# EAGLE design SP (EAGLE 9.4.2)
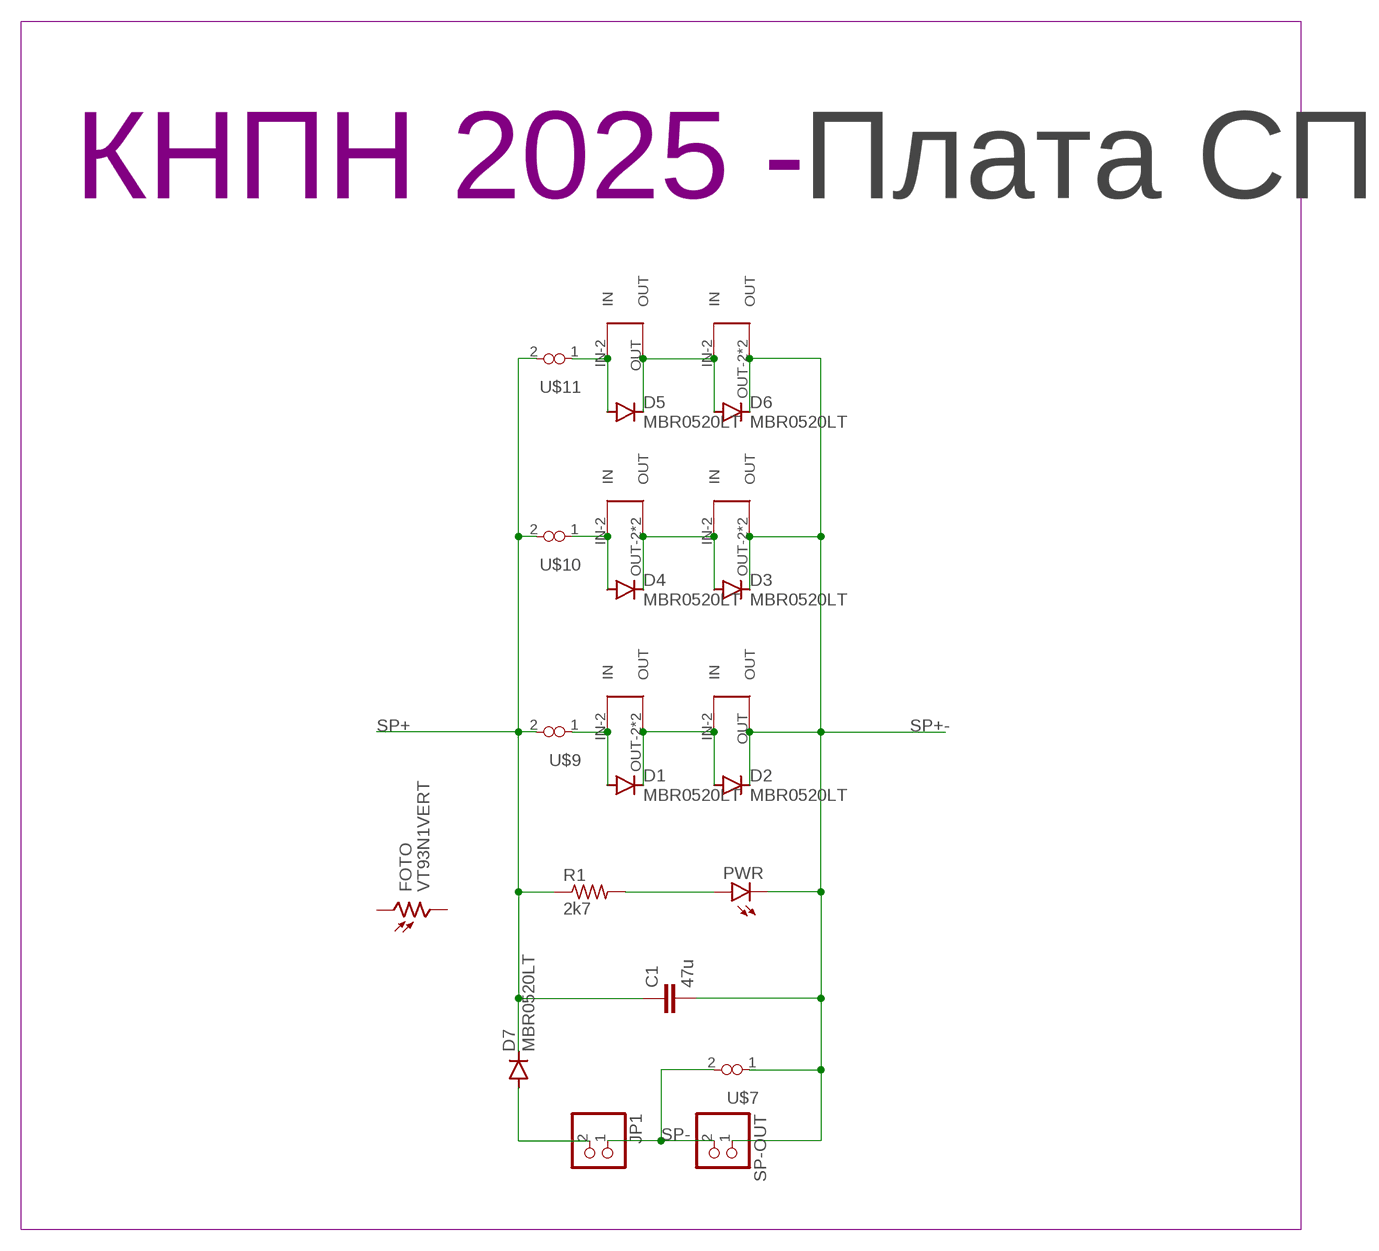
[diagram p0: schematic, sheet 1]

## Parts
C1  47u  C-EUC1210  [C1210]
D1  MBR0520LT  [SOD123]
D2  MBR0520LT  [SOD123]
D3  MBR0520LT  [SOD123]
D4  MBR0520LT  [SOD123]
D5  MBR0520LT  [SOD123]
D6  MBR0520LT  [SOD123]
D7  MBR0520LT  [SOD123]
FOTO  VT93N1VERT  [VT93N1-VERT]
JP1  PINHD-1X2  [1X02]
PWR  LEDCHIP-LED0603  [CHIP-LED0603]
R1  2k7  R-US_R0603  [R0603]
SP-OUT  PINHD-1X2  [1X02]
U$1  SOLAR-2_INVERT0-2  [SOLAR_0-2_INVERT]
U$2  SOLAR-2_INVERT1-2  [SOLAR_1-2_INVERT]
U$3  SOLAR-2_INVERT0-2  [SOLAR_0-2_INVERT]
U$4  SOLAR-2_INVERT0-2  [SOLAR_0-2_INVERT]
U$5  Плата СП  LOGOPCB-""  [LOGO]
U$6  SOLAR-2_INVERT1-2  [SOLAR_1-2_INVERT]
U$7  VIAS-CONNECT  [VIAS-CONNECT]
U$8  SOLAR-2_INVERT0-2  [SOLAR_0-2_INVERT]
U$9  VIAS-CONNECT  [VIAS-CONNECT]
U$10  VIAS-CONNECT  [VIAS-CONNECT]
U$11  VIAS-CONNECT  [VIAS-CONNECT]

## Nets
N$1: D7.A JP1.2
N$2: D5.A U$6.IN-2(IN) U$11.1
N$3: D4.A U$4.IN-2(IN) U$10.1
N$4: PWR.A R1.2
N$5: D1.C D2.A U$1.OUT-2(OUT) U$1.OUT-21(OUT) U$2.IN-2(IN)
N$6: D3.A D4.C U$3.IN-2(IN) U$4.OUT-2(OUT) U$4.OUT-21(OUT)
N$7: D1.A U$1.IN-2(IN) U$9.1
N$8: D5.C D6.A U$6.OUT U$8.IN-2(IN)
SP+: C1.1 D7.C R1.1 U$9.2 U$10.2 U$11.2
SP+-: C1.2 D2.C D3.C D6.C PWR.C SP-OUT.1 U$2.OUT U$3.OUT-2(OUT) U$3.OUT-21(OUT) U$7.1 U$8.OUT-2(OUT) U$8.OUT-21(OUT)
SP-: JP1.1 SP-OUT.2 U$7.2
Unconnected: FOTO.P$1 FOTO.P$2

## Library data of the parts
C1 = rcl:C-EU: CAPACITOR, European symbol; SPICEPREFIX: C
D1-D7 = diode:MBR0520LT: SCHOTTKY BARRIER RECTIFIER Source: http://onsemi.com .. MBR0520LT1-D.pdf
FOTO = KNPN-2023:VT93N1
JP1 SP-OUT = pinhead:PINHD-1X2: PIN HEADER
PWR = led:LED: LED OSRAM: - CHIPLED LG R971, LG N971, LY N971, LG Q971, LY Q971, LO R971, LY R971 LH N974, LH R974 LS Q976, LO Q976, LY Q976 LO Q996 - Hyper CHIPLED LW Q18S LB Q993, LB Q99A, LB R99A - SideLED LS A670, LO A670, LY A670, LG A670, LP A670 LB A673, LV A673, LT A673, LW A673 LH A674 LY A675 LS A676, LA A676, LO A676, LY A676, LW A676 LS A679, LY A679, LG A679 - Hyper Micro SIDELED® LS Y876, LA Y876, LO Y876, LY Y876 LT Y87S - SmartLED LW L88C, LW L88S LB L89C, LB L89S, LG L890 LS L89K, LO L89K, LY L89K LS L896, LA L896, LO L896, LY L896 - TOPLED LS T670, LO T670, LY T670, LG T670, LP T670 LSG T670, LSP T670, LSY T670, LOP T670, LYG T670 LG T671, LOG T671, LSG T671 LB T673, LV T673, LT T673, LW T673 LH T674 LS T676, LA T676, LO T676, LY T676, LB T676, LH T676, LSB T676, LW T676 LB T67C, LV T67C, LT T67C, LS T67K, LO T67K, LY T67K, LW E67C LS E67B, LA E67B, LO E67B, LY E67B, LB E67C, LV E67C, LT E67C LW T67C LS T679, LY T679, LG T679 LS T770, LO T770, LY T770, LG T770, LP T770 LB T773, LV T773, LT T773, LW T773 LH T774 LS E675, LA E675, LY E675, LS T675 LS T776, LA T776, LO T776, LY T776, LB T776 LHGB T686 LT T68C, LB T68C - Hyper Mini TOPLED® LB M676 - Mini TOPLED Santana® LG M470 LS M47K, LO M47K, LY M47K Source: http://www.osram.convergy.de LUXEON: - LUMILED® LXK2-PW12-R00, LXK2-PW12-S00, LXK2-PW14-U00, LXK2-PW14-V00 LXK2-PM12-R00, LXK2-PM12-S00, LXK2-PM14-U00 LXK2-PE12-Q00, LXK2-PE12-R00, LXK2-PE12-S00, LXK2-PE14-T00, LXK2-PE14-U00 LXK2-PB12-K00, LXK2-PB12-L00, LXK2-PB12-M00, LXK2-PB14-N00, LXK2-PB14-P00, LXK2-PB14-Q00 LXK2-PR12-L00, LXK2-PR12-M00, LXK2-PR14-Q00, LXK2-PR14-R00 LXK2-PD12-Q00, LXK2-PD12-R00, LXK2-PD12-S00 LXK2-PH12-R00, LXK2-PH12-S00 LXK2-PL12-P00, LXK2-PL12-Q00, LXK2-PL12-R00 Source: www.luxeon.com KINGBRIGHT: KA-3528ASYC Source: www.kingbright.com
R1 = rcl:R-US_: RESISTOR, American symbol; SPICEPREFIX: R
U$1-U$4 U$6 U$8 = KNPN-2023:SOLAR-2_INVERT
U$5 = UNKNOWN-2024:LOGO
U$7 U$9-U$11 = KNPN-2023:VIAS-CONNECT

## Board
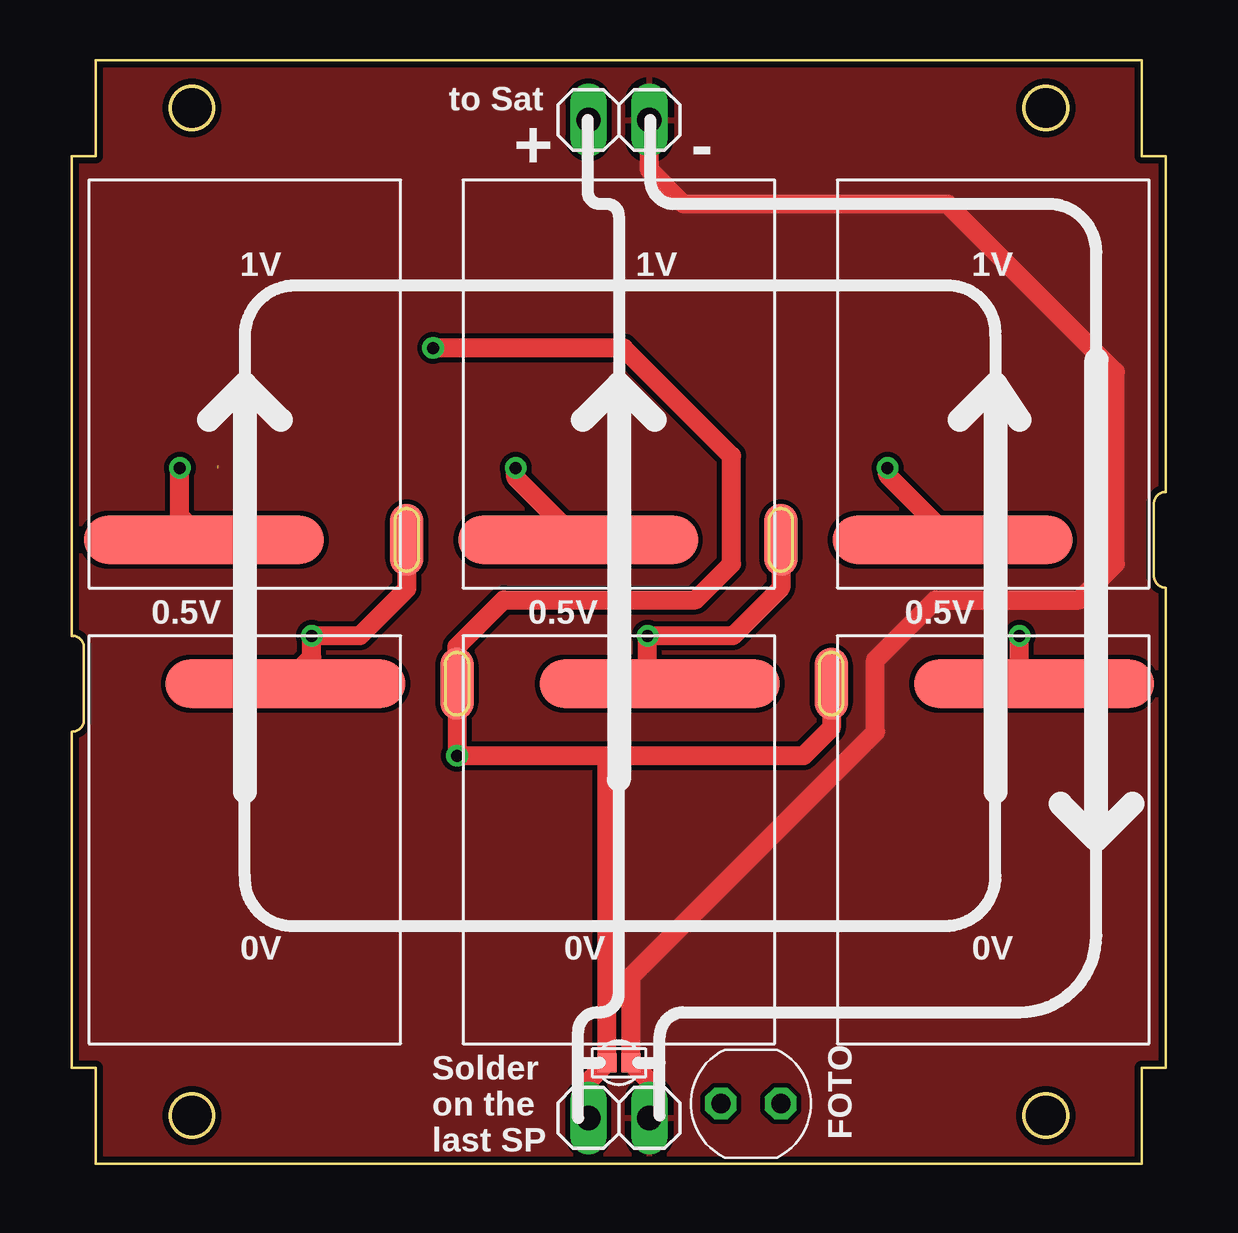
[diagram p1: board, top side]
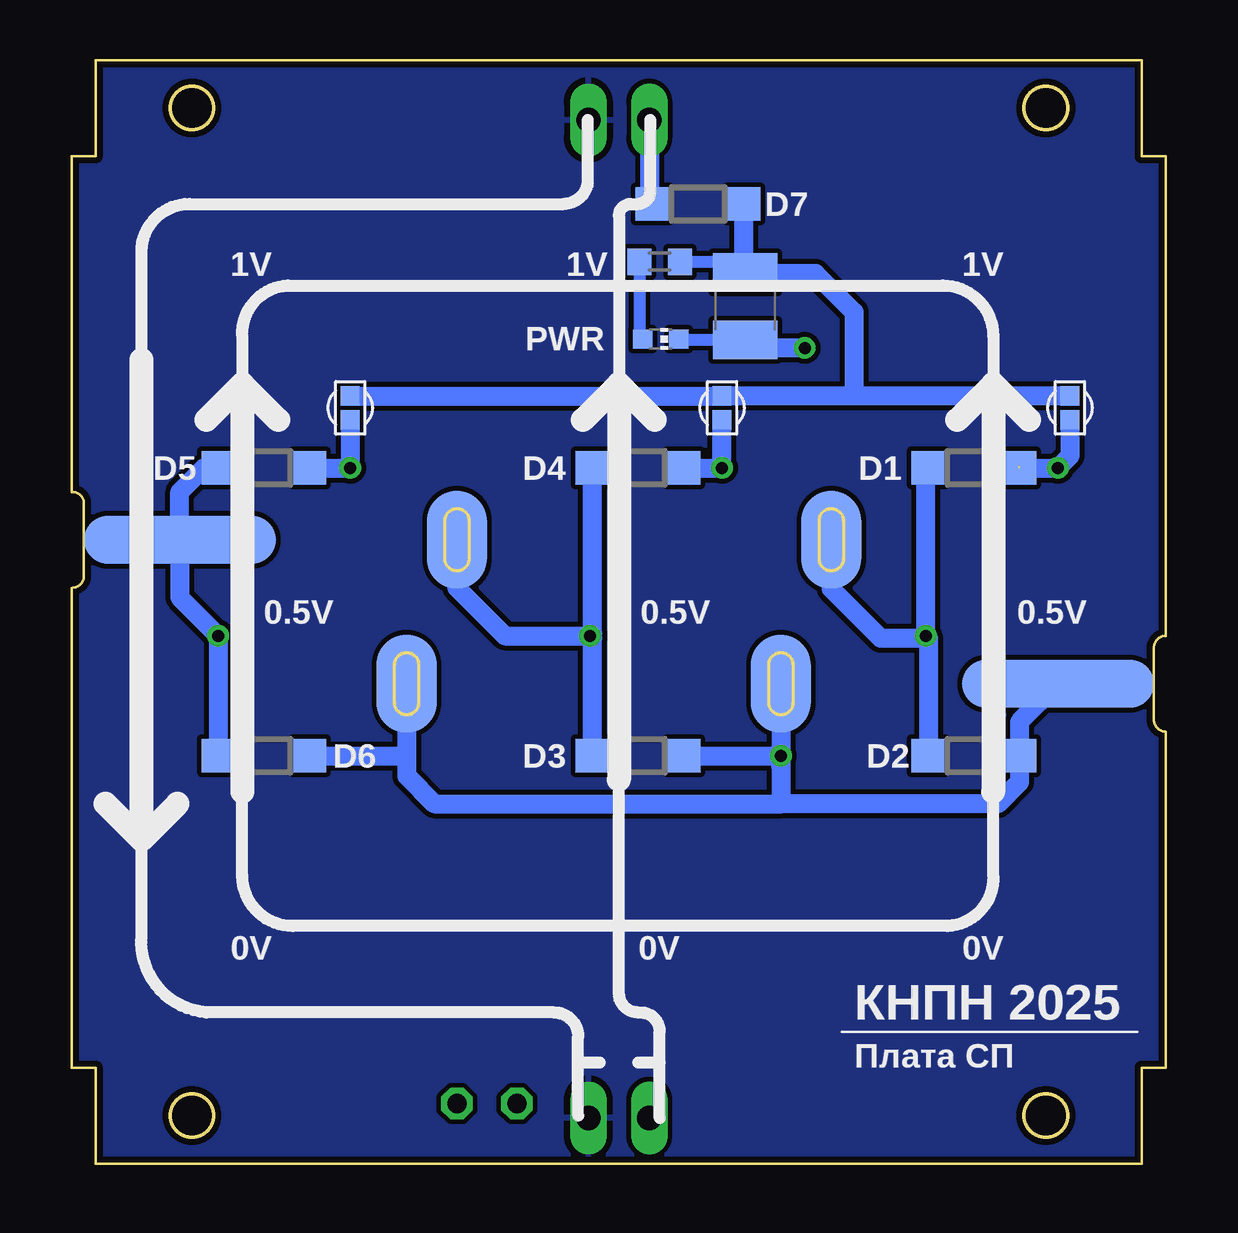
[diagram p2: board, bottom side, seen from below]

Size 45.6 x 46 mm. Coordinates in mm from the lower left corner, seen from the top.
Outline: 1,0 44.6,0 44.6,4 45.6,4 45.6,24 arc-90 45.1,24.5 45.1,27.5 arc-90 45.6,28 45.6,42 44.6,42 44.6,46 1,46 1,42 0,42 0,22 arc-90 0.5,21.5 0.5,18.5 arc-90 0,18 0,4 1,4 1,0
Outline: circle at 5,2 radius 0.9
Outline: circle at 40.6,2 radius 0.9
Outline: circle at 40.6,44 radius 0.9
Outline: circle at 5,44 radius 0.9
Copper layers (1*16): Top 0.035mm / dielectric 1.5mm / Bottom 0.035mm
Design rules "default *": minimum track width 0.25mm, minimum drill 0.35mm, track to track 0.2mm, track to pad 0.2mm, pad to pad 0.2mm, via to via 0.2mm, smd to smd 0.2mm, copper to edge 0.25mm, drill to drill 0.1mm, minimum pad ring 10mil, minimum via ring 8mil, stop-mask expansion 4mil, vias tented up to drill 0mil, thermal gap 10mil

### Footprints (pad centres in the part's own frame; a part is rotated, then mirrored left to right if it is on the bottom)
C1210 = smd 1.6 x 2.7: 1 -1.4,0; 2 1.4,0
SOD123 = smd 1.4 x 1.4: A 1.9,0; C -1.9,0
VT93N1-VERT = drill 0.8 octagon: P$1 -1.25,0; P$2 1.25,0
1X02 = drill 1.016 long: 1 -1.27,0; 2 1.27,0
CHIP-LED0603 = smd 0.8 x 0.8: A 0,-0.75; C 0,0.75
R0603 = smd 1 x 1.1: 1 -0.85,0; 2 0.85,0
SOLAR_0-2_INVERT = smd 2 x 10: IN-2 -6.5,1.7 | smd 4.1 x 2.5 bottom: OUT-2 -6.5,-6.75 | smd 3 x 1.4: OUT-21 -6.5,-6.75
SOLAR_1-2_INVERT = smd 2 x 10: IN-2 -6.5,1.7 | smd 2 x 8 bottom: OUT -6.5,-2.7
VIAS-CONNECT = smd 0.8 x 0.8: 1 -0.5,0; 2 0.5,0

### Placement (x,y rotation side)
C1  17.54,35.74 270 bottom
D1  8,29 0 bottom
D2  8,17 180 bottom
D3  22,17 180 bottom
D4  22,29 0 bottom
D5  37.6,29 0 bottom
D6  37.6,17 180 bottom
D7  19.5,40 180 bottom
FOTO  28.3,2.5 0 top
JP1  22.8,43.5 180 top
PWR  21.06,34.37 270 bottom
R1  21.1,37.59 180 bottom
SP-OUT  22.8,1.9 0 top
U$1  7.2,32.5 90 top
U$2  7.2,13.5 270 top
U$3  22.8,13.5 270 top
U$4  22.8,32.5 90 top
U$5  13.5,5.5 0 bottom
U$6  38.4,32.5 90 top
U$7  22.8,4.2 0 top
U$8  38.4,13.5 270 top
U$9  4,31.5 90 bottom
U$10  18.5,31.5 90 bottom
U$11  34,31.5 90 bottom

### Tracks (layer width: path | path; a pad name or v marks a point on that pad's centre or on a via)
N$1
  Bottom 0.8: JP1.2 21.53,40.13 D7.A
N$2  (via drill 0.5)
  Top 0.8: U$6.IN-2 34,28.7 v34,29
  Bottom 0.8: D5.A v34,29 U$11.1
N$3  (via drill 0.5)
  Top 0.8: U$4.IN-2 18.5,28.6 v18.5,29
  Bottom 0.8: D4.A v18.5,29 U$10.1
N$4
  Bottom 0.5: R1.2 21.95,34.51 PWR.A
N$5  (via drill 0.5)
  Top 0.8: U$1.OUT-21 13.95,23.95 12,22 v10,22 10,21.1 U$2.IN-2
  Bottom 0.8: 9.9,21.9 D2.A | 9.9,21.9 v10,22 10,28.9 D1.C | U$1.OUT-21 13.95,23.95 11.9,21.9 9.9,21.9
N$6  (via drill 0.5)
  Top 0.8: U$3.IN-2 24,20.5 v24,22 27.55,22 29.55,24 U$4.OUT-21
  Bottom 0.8: U$4.OUT-21 29.55,24 27.55,22 v24,22 | D3.A 23.9,21.9 v24,22 | v24,22 23.9,22.1 D4.C
N$7  (via drill 0.5)  (1 unrouted)
  Top 0.8: U$1.IN-2 4.5,27 v4.5,29
  Bottom 0.8: 6.1,29.1 6,29 | D1.A v4.5,29 4,29.5 U$9.1
N$8  (via drill 0.5)
  Top 0.8: U$8.IN-2 39.5,20.6 v39.5,22
  Bottom 0.8: D5.C 40.1,29 41.1,28 U$6.OUT 41.1,23.6 v39.5,22 D6.A
SP+
  Bottom 0.5: R1.1 17.99,37.59 C1.1 17.59,37.09
  Bottom 0.8: D7.C 17.6,37.1 | 17.6,37.1 17.59,37.09 | U$11.2 U$10.2 13,32 | 17.6,37.1 14.6,37.1 13,35.5 13,32 | U$9.2 13,32
SP+-  (via drill 0.5)
  Top 0.8: SP-OUT.1 21.53,3.43 U$7.1 22.3,16.8 22.5,17 | 22.5,17 30.5,17 31.65,18.15 U$8.OUT-21 | 22.5,17 v16.05,17 U$3.OUT-21 16.05,21.55 18,23.5 26,23.5 27.5,25 27.5,29.5 23,34 v15.05,34
  Bottom 0.5: PWR.C 20.28,34.34 C1.2 18.05,34.34
  Bottom 0.8: U$2.OUT 6.1,18.4 D2.C 6.1,15.9 7,15 16,15 | U$3.OUT-21 v16.05,17 | v16.05,17 16.05,16.55 | D3.C v16.05,17 | 16,15 30.5,15 31.65,16.15 31.65,17 | U$8.OUT-21 31.65,17 | D6.C 31.65,17 | v16.05,17 16.05,15.05 16,15 | v15.05,34 17.2,34 C1.2
SP-
  Top 0.8: SP-OUT.2 24.07,3.43 U$7.2 23.3,7.8 33.5,18 33.5,21 36,23.5 42,23.5 43.5,25 43.5,33 36.5,40 25.5,40 24.07,41.43 JP1.1
  pour Top: -0.5,46.5 46.5,46.5 46.5,-0.5 -0.5,-0.5
  pour Bottom: -1,47 47,47 47,-1 -1,-1

### Text on the board
tPlace: 1V | 1V | 1V | 0.5V | 0.5V | 0.5V | 0V | 0V | 0V
bPlace: 1V | 1V | 1V | 0.5V | 0.5V | 0.5V | 0V | 0V | 0V
tNames: to Sat | + | - | Solder / on the / last SP